# EAGLE design smartsensorRevB (EAGLE 6.5.0)
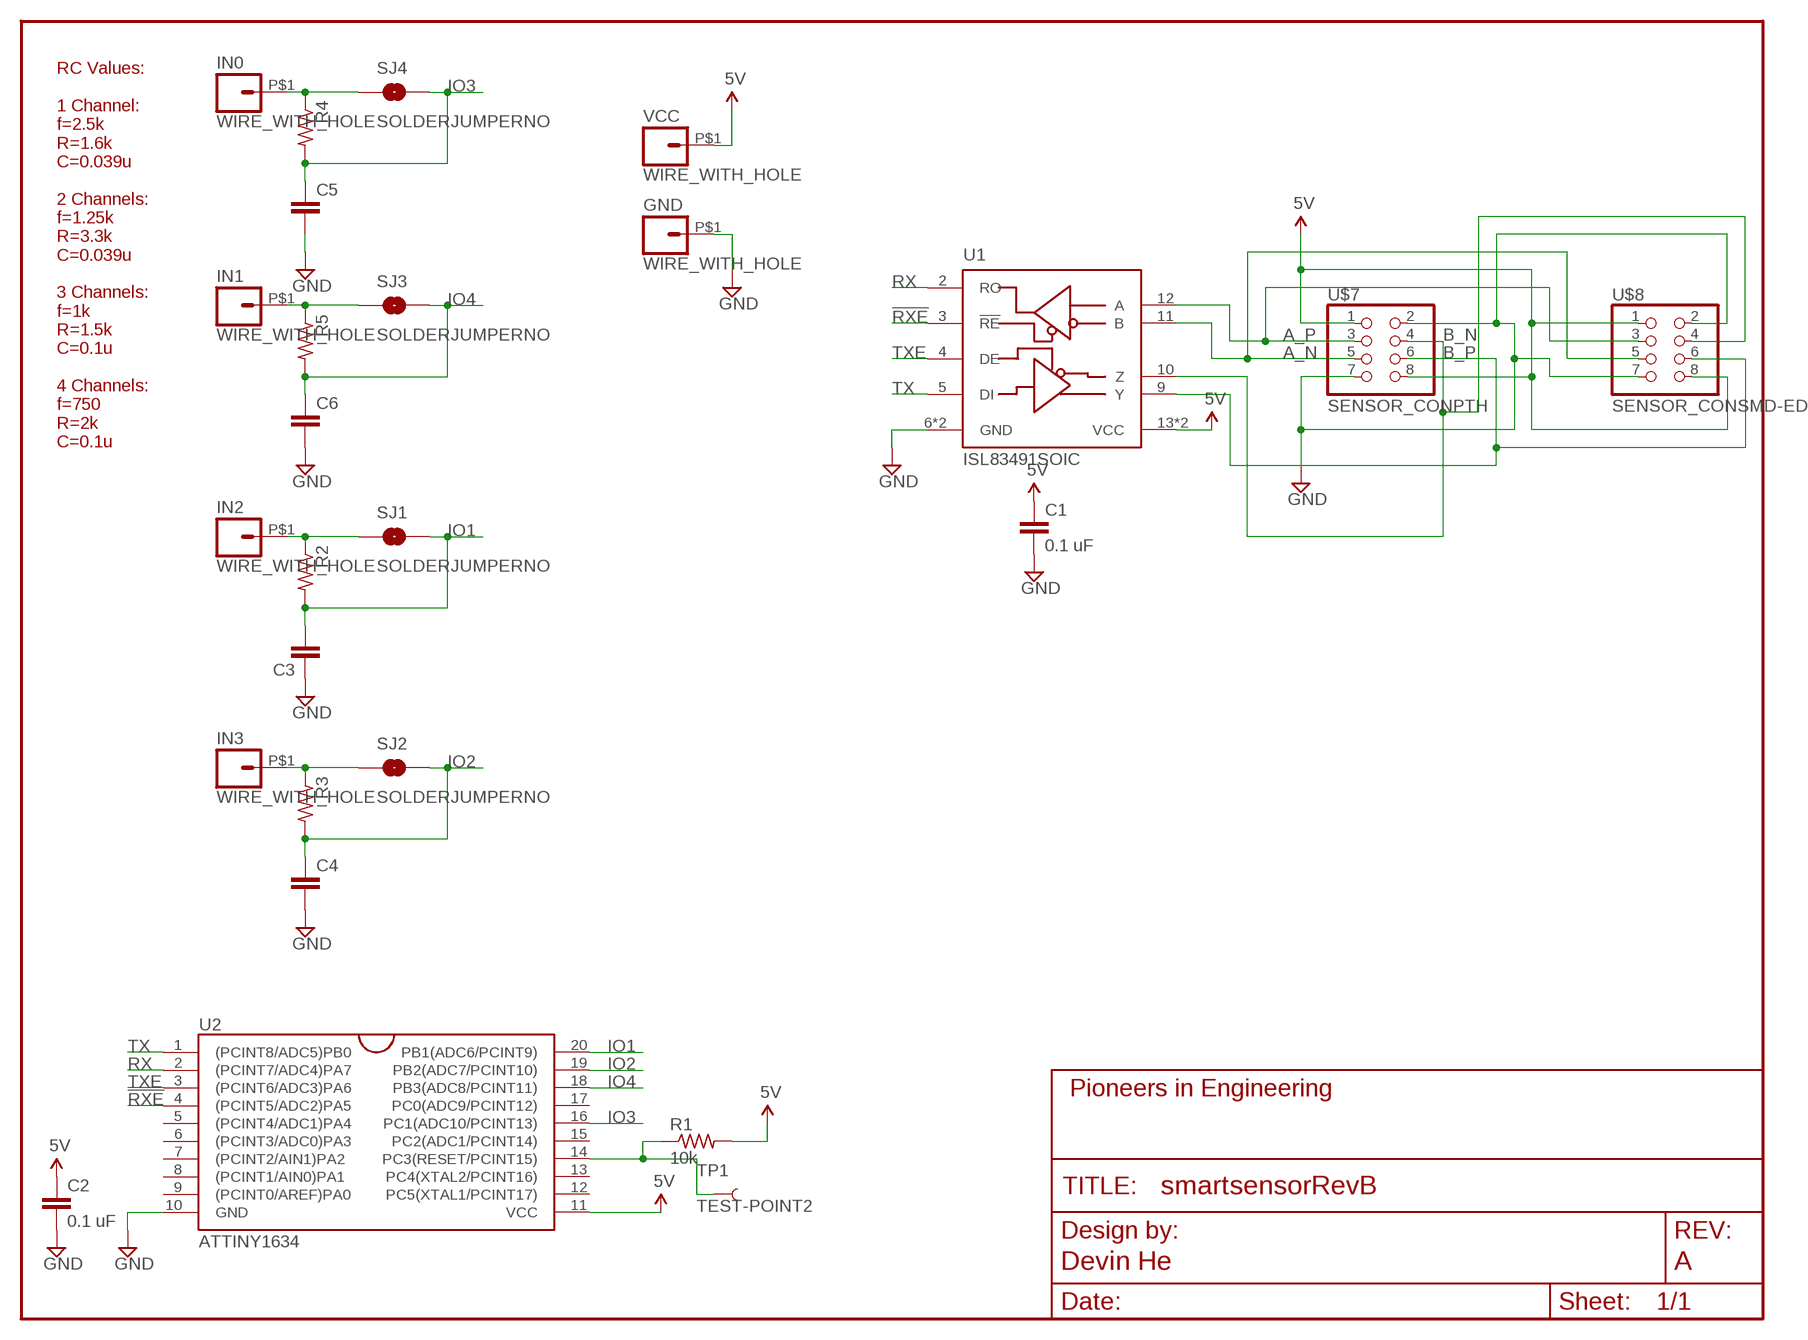
[diagram p0: schematic, sheet 1]
FRAME1 (FRAME-LETTER): AUTHOR: Devin He; REVISION: A

## Parts
C1  0.1 uF  CAP0603-CAP  [0603-CAP]
C2  0.1 uF  CAP0603-CAP  [0603-CAP]
C3  CAP0603-CAP  [0603-CAP]
C4  CAP0603-CAP  [0603-CAP]
C5  CAP0603-CAP  [0603-CAP]
C6  CAP0603-CAP  [0603-CAP]
GND  WIRE_WITH_HOLE  [WIRE_WITH_HOLE]
IN0  WIRE_WITH_HOLE  [WIRE_WITH_HOLE]
IN1  WIRE_WITH_HOLE  [WIRE_WITH_HOLE]
IN2  WIRE_WITH_HOLE  [WIRE_WITH_HOLE]
IN3  WIRE_WITH_HOLE  [WIRE_WITH_HOLE]
R1  10k  R-US_R0603  [R0603]
R2  R-US_R0603  [R0603]
R3  R-US_R0603  [R0603]
R4  R-US_R0603  [R0603]
R5  R-US_R0603  [R0603]
SJ1  SOLDERJUMPERNO  [SJ_2S-NO]
SJ2  SOLDERJUMPERNO  [SJ_2S-NO]
SJ3  SOLDERJUMPERNO  [SJ_2S-NO]
SJ4  SOLDERJUMPERNO  [SJ_2S-NO]
TP1  TEST-POINT2  [PAD.02X.02]
U1  ISL83491SOIC  [SOIC14]
U2  ATTINY1634  [SOIC20S]
U$7  SENSOR_CONPTH  [2X4]
U$8  SENSOR_CONSMD-EDGE  [2X4-EDGE]
VCC  WIRE_WITH_HOLE  [WIRE_WITH_HOLE]

## Nets
5V: C1.1 C2.1 R1.2 U1.13(VCC) U1.14(VCC) U2.11(VCC) U$7.1 U$7.8 U$8.1 U$8.8 VCC.P$1
!RXE: U1.3(!RE) U2.4((PCINT5/ADC2)PA5)
A_N: U1.11(B) U$7.5 U$8.5
A_P: U1.12(A) U$7.3 U$8.3
B_N: U1.10(Z) U$7.4 U$8.4
B_P: U1.9(Y) U$7.6 U$8.6
CONN1: IN2.P$1 R2.1 SJ1.1
CONN2: IN3.P$1 R3.1 SJ2.1
CONN3: IN0.P$1 R4.1 SJ4.1
CONN4: IN1.P$1 R5.1 SJ3.1
GND: C1.2 C2.2 C3.1 C4.2 C5.2 C6.2 GND.P$1 U1.6(GND) U1.7(GND) U2.10(GND) U$7.2 U$7.7 U$8.2 U$8.7
IO1: C3.2 R2.2 SJ1.2 U2.20(PB1(ADC6/PCINT9))
IO2: C4.1 R3.2 SJ2.2 U2.19(PB2(ADC7/PCINT10))
IO3: C5.1 R4.2 SJ4.2 U2.16(PC1(ADC10/PCINT13))
IO4: C6.1 R5.2 SJ3.2 U2.18(PB3(ADC8/PCINT11))
RESET: R1.1 TP1.P$1 U2.14(PC3(RESET/PCINT15))
RX: U1.2(RO) U2.2((PCINT7/ADC4)PA7)
TX: U1.5(DI) U2.1((PCINT8/ADC5)PB0)
TXE: U1.4(DE) U2.3((PCINT6/ADC3)PA6)
Unconnected: U2.5((PCINT4/ADC1)PA4) U2.6((PCINT3/ADC0)PA3) U2.7((PCINT2/AIN1)PA2) U2.8((PCINT1/AIN0)PA1) U2.9((PCINT0/AREF)PA0) U2.12(PC5(XTAL1/PCINT17)) U2.13(PC4(XTAL2/PCINT16)) U2.15(PC2(ADC1/PCINT14)) U2.17(PC0(ADC9/PCINT12))

## Notes on the sheet
- RC Values:
  
  1 Channel:
  f=2.5k
  R=1.6k
  C=0.039u
  
  2 Channels:
  f=1.25k
  R=3.3k
  C=0.039u
  
  3 Channels:
  f=1k
  R=1.5k
  C=0.1u
  
  4 Channels:
  f=750
  R=2k
  C=0.1u

## Library data of the parts
C1-C6 = pie:CAP: Capacitor Standard 0603 ceramic capacitor, and 0.1" leaded capacitor.; PIE-INT-REF-NUM: CAPACITOR-GENERIC
GND IN0 IN1-IN3 VCC = pie:WIRE_WITH_HOLE; PIE-INT-REF-NUM: DNL
R1-R5 = pie:R-US_: RESISTOR, American symbol; PIE-INT-REF-NUM: RESISTOR-GENERIC
SJ1-SJ4 = pie:SOLDERJUMPER: Solder Jumper Standard SMD solder jumper. Used to automate production. Two varients : Normally Open and Normally Closed are the same, but have different paste layers. NC will have a large amount of paste and should jumper during reflow.; PIE-INT-REF-NUM: DNL
TP1 = pie:TEST-POINT: Bare copper test points for troubleshooting or ICT; PIE-INT-REF-NUM: DNL
U1 = pie:ISL83491; PIE-INT-REF-NUM: rs485_491
U2 = pie:ATTINY1634; PIE-INT-REF-NUM: ATtiny1634
U$7 U$8 = pie:SENSOR_CON; PIE-INT-REF-NUM: BULK-STOCK

## Board
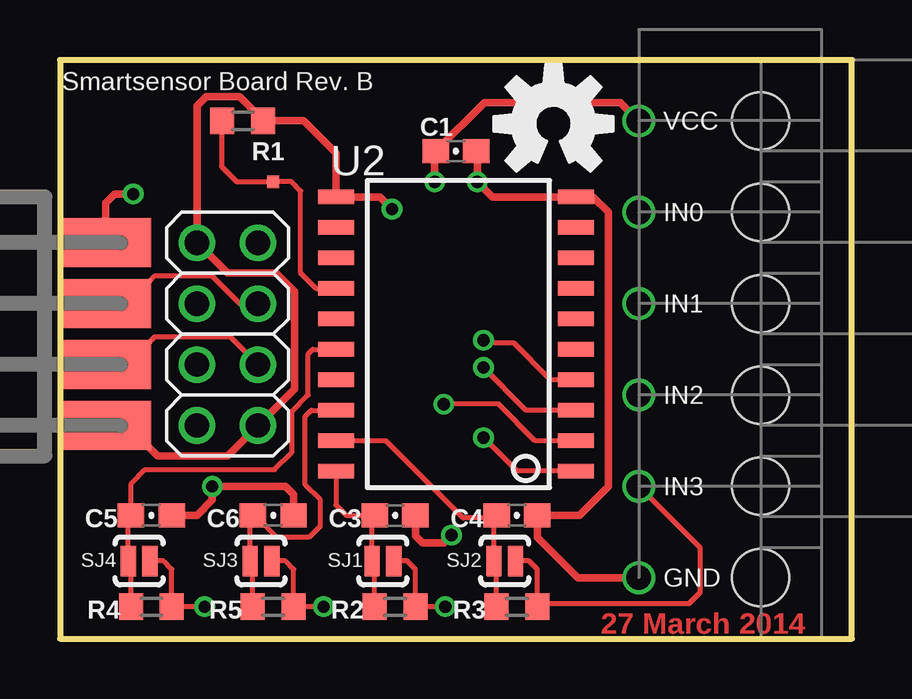
[diagram p1: board, top side]
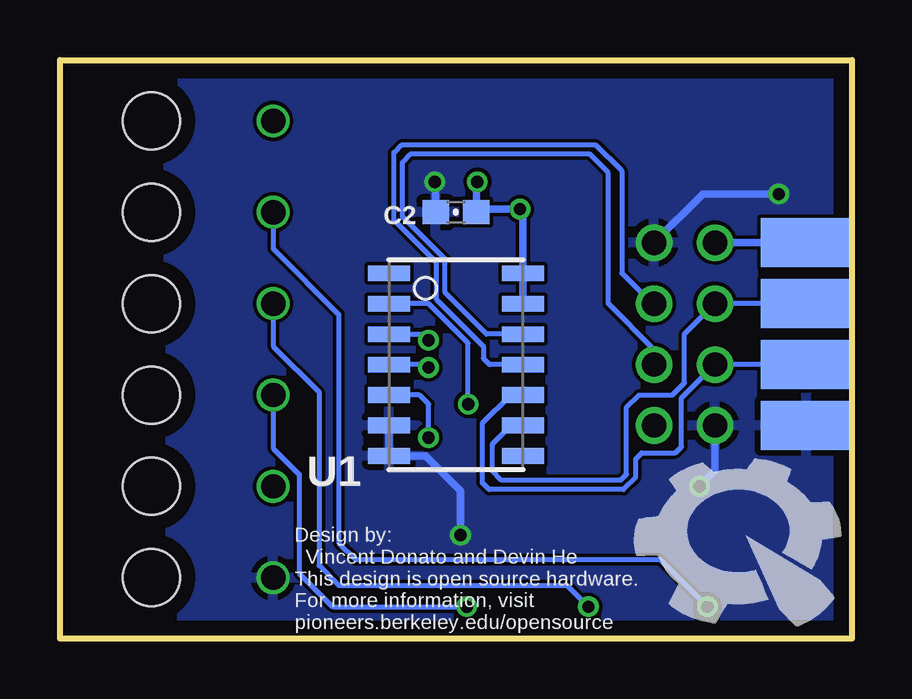
[diagram p2: board, bottom side, seen from below]

Size 33.02 x 24.13 mm. Coordinates in mm from the lower left corner, seen from the top.
Outline: 0,0 33.02,0 33.02,24.13 0,24.13 0,0
Copper layers (1*16): Top 2mil / dielectric 9mil / Bottom 2mil
Design rules "advancedcircuits-33each-pie": minimum track width 6mil, minimum drill 15mil, track to track 6mil, track to pad 10mil, pad to pad 6mil, via to via 6mil, smd to smd 6mil, copper to edge 25mil, drill to drill 7mil, minimum pad ring 7mil, minimum via ring 7mil, stop-mask expansion 3mil, vias tented up to drill 21mil, thermal gap 10mil

### Footprints (pad centres in the part's own frame; a part is rotated, then mirrored left to right if it is on the bottom)
0603-CAP = smd 1.1 x 1: 1 -0.85,0; 2 0.85,0
WIRE_WITH_HOLE = drill 1.016: P$1 -2.54,0 | hole 2.381: 2.54,0
R0603 = smd 1 x 1.1: 1 -0.85,0; 2 0.85,0
SJ_2S-NO = smd 0.635 x 1.27: 1 -0.45,0; 2 0.45,0
PAD.02X.02 = smd 0.508 x 0.508: P$1 0,0
SOIC14 = smd 1.75 x 0.65: 1 -2.8,3.81; 2 -2.8,2.54; 3 -2.8,1.27; 4 -2.8,0; 5 -2.8,-1.27; 6 -2.8,-2.54; 7 -2.8,-3.81; 8 2.8,-3.81; 9 2.8,-2.54; 10 2.8,-1.27; 11 2.8,0; 12 2.8,1.27; 13 2.8,2.54; 14 2.8,3.81
SOIC20S = smd 0.6 x 1.5: 1 0.635,-1.19; 2 1.905,-1.19; 3 3.175,-1.19; 4 4.445,-1.19; 5 5.715,-1.19; 6 6.985,-1.19; 7 8.255,-1.19; 8 9.525,-1.19; 9 10.795,-1.19; 10 12.065,-1.19; 11 12.065,8.81; 12 10.795,8.81; 13 9.525,8.81; 14 8.255,8.81; 15 6.985,8.81; 16 5.715,8.81; 17 4.445,8.81; 18 3.175,8.81; 19 1.905,8.81; 20 0.635,8.81
2X4 = drill 1.016 pad 1.524: 1 -3.81,-1.27; 2 -3.81,1.27; 3 -1.27,-1.27; 4 -1.27,1.27; 5 1.27,-1.27; 6 1.27,1.27; 7 3.81,-1.27; 8 3.81,1.27
2X4-EDGE = smd 3.81 x 2.032: 1 -2.54,3.81; 3 -2.54,1.27; 5 -2.54,-1.27; 7 -2.54,-3.81 | smd 3.81 x 2.032 bottom: 2 -2.54,3.81; 4 -2.54,1.27; 6 -2.54,-1.27; 8 -2.54,-3.81

### Placement (x,y rotation side)
C1  16.51,20.32 0 top
C2  16.51,17.78 180 bottom
C3  13.97,5.14 180 top
C4  19.05,5.14 0 top
C5  3.81,5.14 0 top
C6  8.89,5.14 0 top
GND  26.67,2.54 0 top
IN0  26.67,17.78 0 top
IN1  26.67,13.97 0 top
IN2  26.67,10.16 0 top
IN3  26.67,6.35 0 top
R1  7.62,21.59 0 top
R2  13.97,1.33 180 top
R3  19.05,1.33 180 top
R4  3.81,1.33 180 top
R5  8.89,1.33 180 top
SJ1  13.46,3.24 180 top
SJ2  18.54,3.24 180 top
SJ3  8.38,3.24 180 top
SJ4  3.3,3.24 180 top
TP1  8.89,19.05 0 top
U1  16.51,11.43 0 bottom
U2  20.32,6.35 90 top
U$1  [PIE-LOGO-SMALL]  4.45,4.32 0 bottom
U$7  6.99,12.7 90 top
U$8  -0.64,12.7 180 top
U$10  [OSHW-LOGO-M]  20.57,21.46 0 top
VCC  26.67,21.59 0 top

### Tracks (layer width: path | path; a pad name or v marks a point on that pad's centre or on a via)
5V  (via drill 0.51)
  Top 0.203: C1.1 15.62,20.32 | U$8.1 2.54,8.89 | R1.2 8.47,21.63
  Top 0.305: VCC.P$1 23.37,22.35 17.69,22.35 C1.1 | v13.84,17.91 13.34,18.41 U2.11 11.51,20.24 10.16,21.59 R1.2 | 15.62,20.32 v15.62,19.05 | 8.47,21.63 7.49,22.61 6.1,22.61 5.71,22.23 U$7.8 6.99,15.24 9.02,15.24 9.78,14.48 9.78,10.41 U$7.1 6.99,7.62 4.06,7.62 3.17,8.51 2.92,8.51 2.54,8.89
  Bottom 0.203: 15.24,17.78 C2.1 15.53,17.91 | v15.62,19.05 15.66,19.05
  Bottom 0.305: 15.53,17.91 v13.84,17.91 13.71,17.77 U1.14 U1.13 | 15.66,19.05 C2.1 | U$8.8 U$7.8
!RXE  (via drill 0.51)
  Top 0.203: U2.4 20.45,10.79 18.92,12.32 17.78,12.32 v17.65,12.45
  Bottom 0.203: U1.3 19.18,12.57 19.05,12.7 17.91,12.7 v17.65,12.45
A_N
  Top 0.203: U$8.5 3.56,13.97 3.68,14.1 3.68,14.86 3.94,15.11 6.35,15.11 7.49,13.97 U$7.5
  Bottom 0.203: U1.11 15.11,11.43 15.37,11.68 15.37,12.19 17.32,14.15 17.32,15.67 19.1,17.45 19.1,20.27 18.79,20.57 10.67,20.57 9.6,19.51 9.6,15.24 8.33,13.97 U$7.5
A_P
  Top 0.203: U$7.3 7.09,12.6 3.96,12.6 3.3,11.94 2.41,11.94 U$8.3
  Bottom 0.203: U1.12 15.24,12.7 16.97,14.43 16.97,15.82 18.75,17.6 18.75,19.86 18.42,20.19 10.92,20.19 10.16,19.43 10.16,13.97 8.26,12.06 U$7.3
B_N
  Bottom 0.203: U1.10 14.22,10.16 15.42,8.96 15.42,6.51 15.13,6.22 9.53,6.22 9.02,6.73 9.02,7.49 8.76,7.75 7.37,7.75 7.11,8 7.11,10.03 U$7.4 U$8.4
B_P
  Bottom 0.152: 14.22,8.89 U1.9
  Bottom 0.203: U$8.6 U$7.6 6.99,12.7 6.99,10.67 7.49,10.16 8.89,10.16 9.4,9.65 9.4,6.86 9.65,6.6 14.61,6.6 14.99,6.99 14.99,8.13 14.22,8.89
CONN1  (via drill 0.51)
  Top 0.203: v16.07,1.33 R2.1 14.82,2.9 14.48,3.24 SJ1.1
  Bottom 0.203: IN2.P$1 24.13,7.94 23.05,6.86 23.05,2.73 21.65,1.33 v16.07,1.33
CONN2
  Top 0.203: R3.1 19.9,2.9 19.56,3.24 SJ2.1 | IN3.P$1 26.67,3.81 26.67,1.91 26.23,1.46 20.03,1.46 R3.1 | 20.09,1.52 R3.1
CONN3  (via drill 0.51)
  Top 0.203: SJ4.1 4.32,3.24 4.66,2.9 R4.1 v6.03,1.33
  Bottom 0.203: IN0.P$1 24.13,16.26 21.4,13.53 21.4,4 20.7,3.3 8,3.3 v6.03,1.33
CONN4  (via drill 0.51)
  Top 0.203: SJ3.1 9.4,3.24 9.74,2.9 R5.1 v10.99,1.33
  Bottom 0.203: IN1.P$1 24.13,12.19 22.23,10.29 22.23,3.05 21.4,2.22 11.87,2.22 v10.99,1.33
GND  (via drill 0.51)
  Top 0.203: 22.23,18.41 U2.10 | C1.2 17.4,20.32 | U$8.7 1.91,17.4 | C3.1 14.82,5.18
  Top 0.305: 17.4,20.32 v17.4,19.05 18.03,18.41 U2.10 | v3.05,18.54 2.29,18.54 1.91,18.16 U$8.7 | C6.2 9.74,6.01 9.4,6.35 v6.35,6.35 6.35,5.78 5.71,5.14 C5.2 | 22.23,18.41 22.86,17.78 22.86,6.35 21.65,5.14 C4.2 19.9,4.23 21.59,2.54 GND.P$1 | 14.82,5.18 14.82,4.29 15.11,4 16,4 v16.32,4.32
  Bottom 0.203: v17.4,19.05 17.36,19.05 | U1.7 19.05,7.62
  Bottom 0.305: 17.36,19.05 C2.2 | v3.05,18.54 6.22,18.54 U$7.7 | U1.6 U1.7 17.78,7.62 16.32,6.16 v16.32,4.32 | U$7.2 5.71,6.99 v6.35,6.35
  pour Bottom: 0,0 0,24.13 33.02,24.13 33.02,0
IO1
  Top 0.203: 11.52,7 U2.20 11.51,5.57 11.94,5.14 C3.2 13.01,5.04 SJ1.2 13.12,3.13 R2.2
IO2
  Top 0.203: R3.2 18.2,3.13 SJ2.2 18.09,5.04 | 18.09,5.04 C4.1 | 18.09,5.04 16.81,5.04 13.59,8.26 U2.19
IO3
  Top 0.203: R4.2 2.96,3.13 SJ4.2 2.85,5.04 C5.1 2.96,6.45 3.56,7.05 8.95,7.05 9.65,7.75 9.65,9.46 10.35,10.16 10.35,11.87 10.54,12.06 U2.16
IO4
  Top 0.203: R5.2 8.04,3.13 SJ3.2 7.93,5.04 C6.1 8.13,5.14 9.02,4.25 10.41,4.25 10.86,4.7 10.86,5.78 10.22,6.41 10.22,9.27 10.48,9.53 U2.18
RESET
  Top 0.203: U2.14 10.67,14.61 10.03,15.24 10.03,18.67 9.65,19.05 TP1.P$1 7.37,19.05 6.73,19.68 6.73,21.55 R1.1
RX  (via drill 0.51)
  Top 0.203: U2.2 19.81,8.26 18.29,9.78 v16,9.78
  Bottom 0.203: v16,9.78 16,12.32 17.65,13.97 U1.2
TX  (via drill 0.51)
  Top 0.203: U2.1 19.05,6.99 v17.65,8.38
  Bottom 0.203: v17.65,8.38 17.65,9.78 18.03,10.16 U1.5
TXE  (via drill 0.51)
  Top 0.203: U2.3 19.43,9.53 v17.65,11.3
  Bottom 0.203: 19.18,11.3 U1.4 17.78,11.43 v17.65,11.3

### Text on the board
Top: 27 March 2014
tPlace: Smartsensor Board Rev. B
bPlace: Design by: / Vincent Donato and Devin He / This design is open source hardware. / For more information, visit / pioneers.berkeley.edu/opensource